# EAGLE design Adafruit Si5351A (EAGLE 7.7.0)
COMPANY: ADAFRUIT INDUSTRIES; DRAWN: KTOWN; REV: B
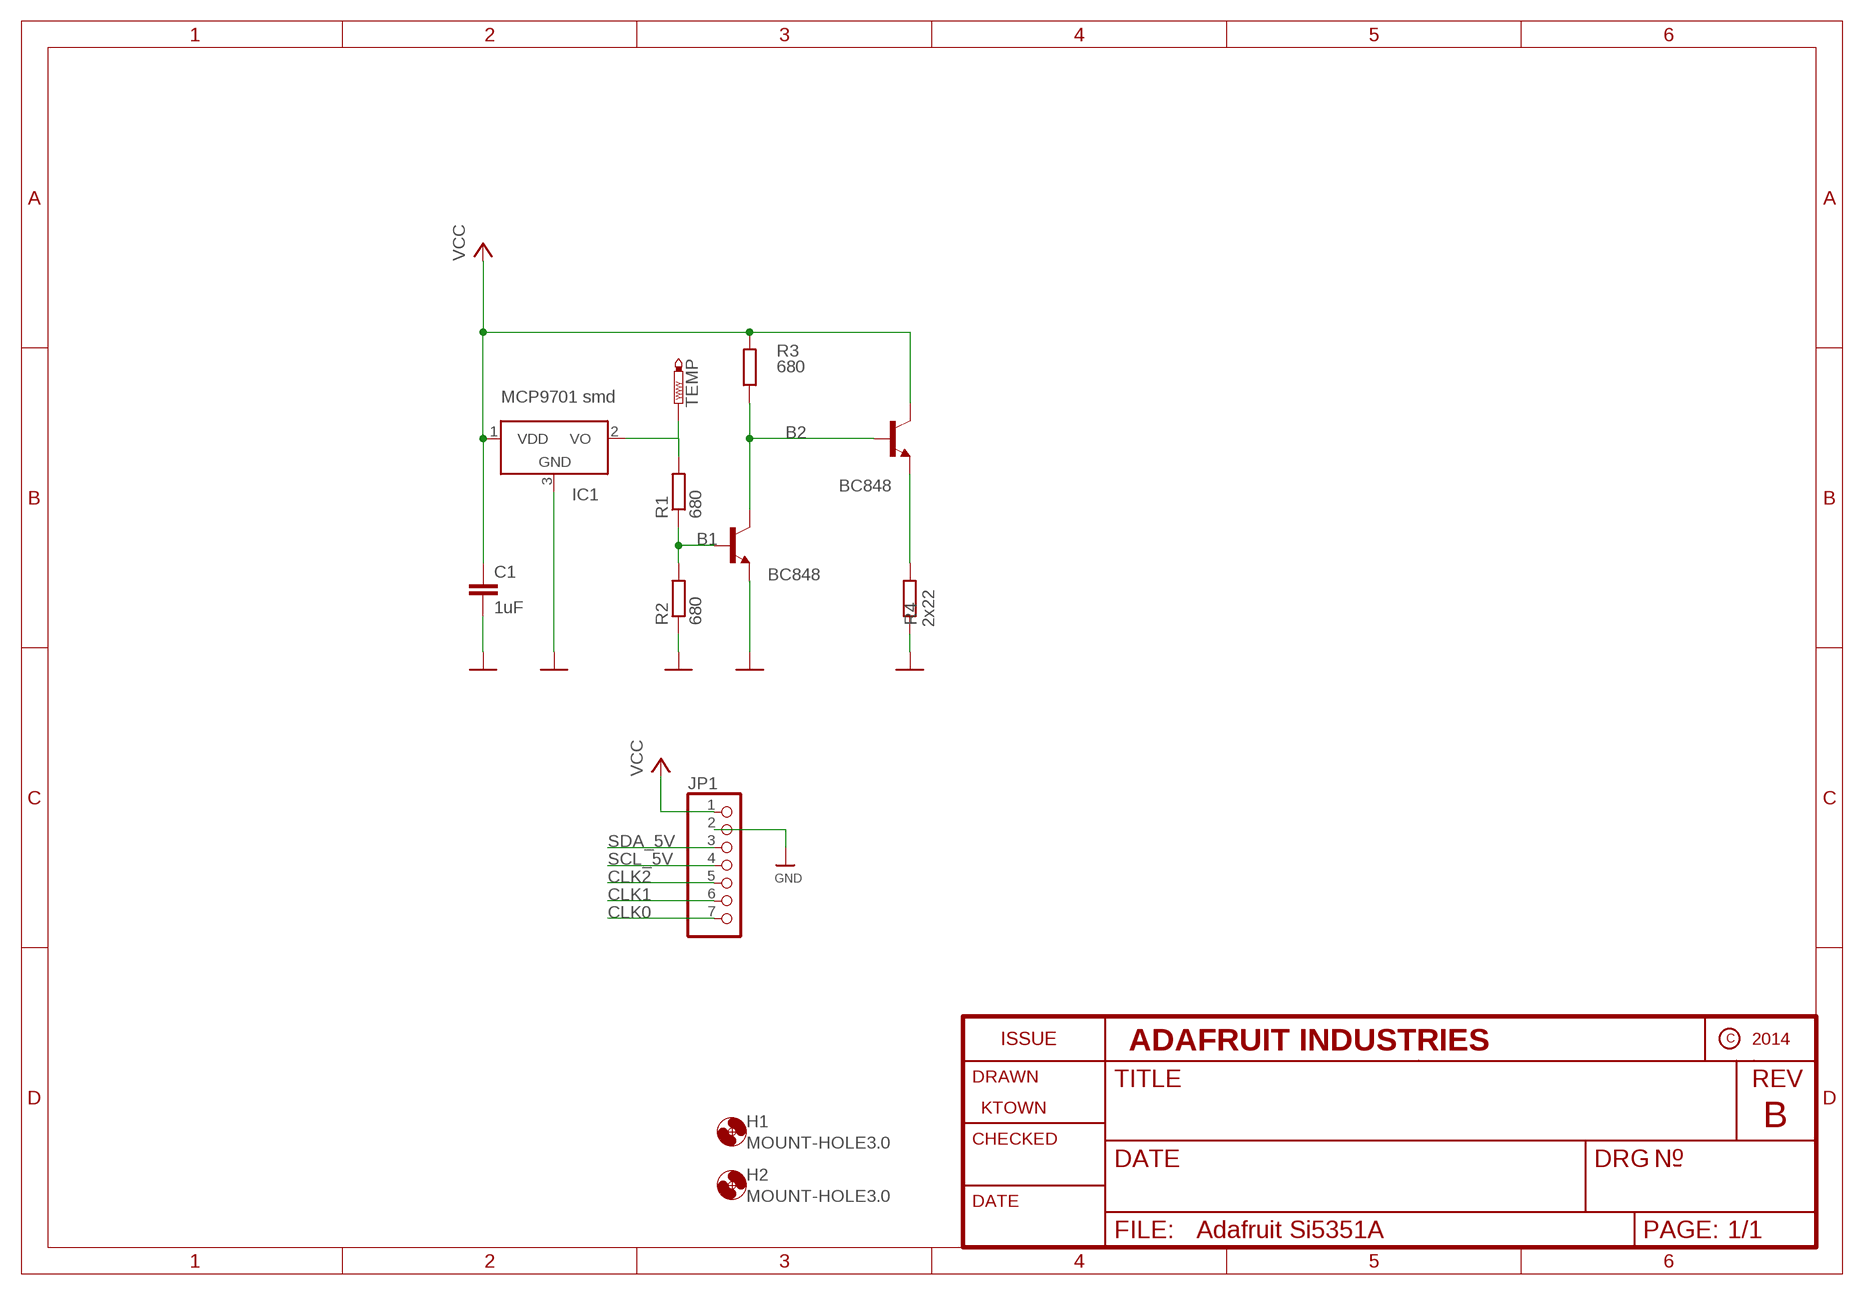
[diagram p0: schematic, sheet 1]

## Parts
C1  1uF  CAPX5R  [C1210]
H1  MOUNT-HOLE3.0  [3,0]
H2  MOUNT-HOLE3.0  [3,0]
IC1  MCP9701 smd  MCP9700T  [SOT23-3]
JP1  HEADER-1X7THICKER  [1X07_ROUND_76]
R1  680  R-EU_M1206  [M1206]
R2  680  R-EU_M1206  [M1206]
R3  680  R-EU_M1206  [M1206]
R4  2x22  R-EU_M1206  [M1206]
T1  BC848  [SOT23]
T2  BC848  [SOT23]
TEMP  PTR1TP10SQ  [TP10SQ]

## Nets
B1: R1.1 R2.2 T1.1(B)
B2: R3.1 T1.3(C) T2.1(B)
CLK0: JP1.7
CLK1: JP1.6
CLK2: JP1.5
E2: R4.2 T2.2(E)
GND: C1.2 IC1.3(GND) JP1.2 R2.1 R4.1 T1.2(E)
SCL_5V: JP1.4
SDA_5V: JP1.3
TEMP: IC1.2(VO) R1.2 TEMP.TP
VCC: C1.1 IC1.1(VDD) JP1.1 R3.2 T2.3(C)

## Library data of the parts
C1 = rcl:CAP: Fihls CAPACITOR 10uF/6V3(445-1363-1-ND), 100nF, 10nF, ..
H1 H2 = holes:MOUNT-HOLE: MOUNTING HOLE with drill center marker
IC1 = interGATE4:MCP9700T: SOT-23-3 Single-Supply Centigrade Temperature Sensor Vout = (10mV/°C x Temp °C) + ??? Digikey MCP9700T-E/TTCT-ND http://www.mouser.com/ds/2/268/21942e-53364.pdf
JP1 = microbuilder:HEADER-1X7: PIN HEADER
R1-R4 = rcl:R-EU_: RESISTOR, European symbol
T1 T2 = transistor:BC848: NPN TRANSISTOR
TEMP = testpad:PTR1: TEST PIN

## Board
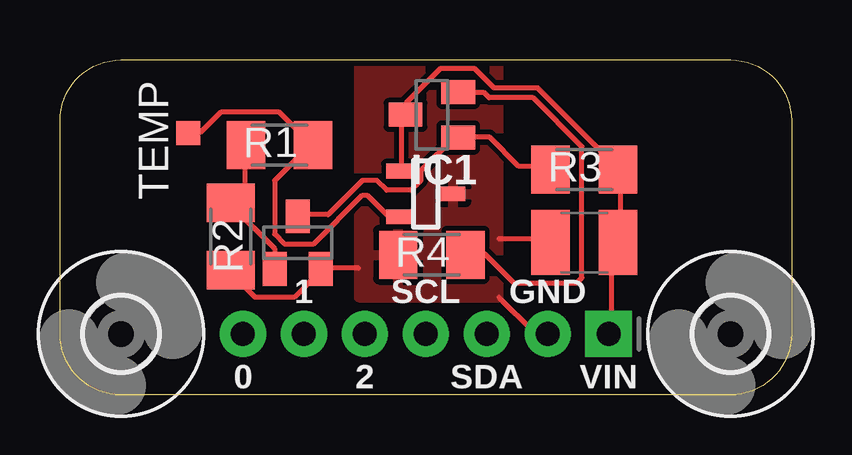
[diagram p1: board, top side]
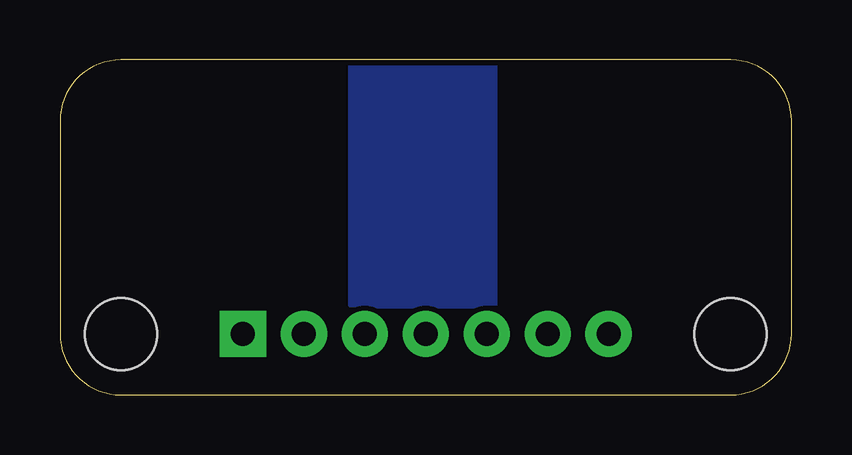
[diagram p2: board, bottom side, seen from below]

Size 30.48 x 13.97 mm. Coordinates in mm from the lower left corner, seen from the top.
Outline: 0,2.54 0,11.43 arc-90 2.54,13.97 27.94,13.97 arc-90 30.48,11.43 30.48,2.54 arc-90 27.94,0 2.54,0 arc-90 0,2.54
Copper layers (1*16): Top 0.035mm / dielectric 1.5mm / Bottom 0.035mm
Design rules "adafruit": minimum track width 8mil, minimum drill 15.5mil, track to track 8mil, track to pad 8mil, pad to pad 8mil, via to via 8mil, smd to smd 8mil, copper to edge 10mil, drill to drill 8mil, minimum pad ring 10mil, minimum via ring 8mil, stop-mask expansion 2mil, vias tented up to drill 20mil, thermal gap 10mil

### Footprints (pad centres in the part's own frame; a part is rotated, then mirrored left to right if it is on the bottom)
C1210 = smd 1.6 x 2.7: 1 -1.4,0; 2 1.4,0
3,0 = hole 3: 0,0
SOT23-3 = smd 0.61 x 1.016: 1 -0.953,-1.143; 2 0.953,-1.143; 3 0,1.143
1X07_ROUND_76 = drill 1 pad 1.93 square: 1 -7.62,0 | drill 1 pad 1.93: 2 -5.08,0; 3 -2.54,0; 4 0,0; 5 2.54,0; 6 5.08,0; 7 7.62,0
M1206 = smd 1.6 x 2: 1 -1.4,0; 2 1.4,0
SOT23 = smd 1 x 1.4: 1 -0.95,-1.1; 2 0.95,-1.1; 3 0,1.1
TP10SQ = smd 1 x 1: TP 0,0

### Placement (x,y rotation side)
C1  21.84,6.35 180 top
H1  27.94,2.54 0 top
H2  2.54,2.54 0 top
IC1  15.24,8.38 270 top
JP1  15.24,2.54 180 top
R1  9.14,10.41 0 top
R2  7.11,6.6 90 top
R3  21.84,9.4 0 top
R4  15.49,5.84 0 top
T1  9.91,6.35 0 top
T2  15.49,11.68 90 top
TEMP  5.33,10.92 0 top

### Tracks (layer width: path | path; a pad name or v marks a point on that pad's centre or on a via)
B1
  Top 0.203: T1.1 8.94,5.28 8.94,6.1 7.11,7.92 R2.2 7.11,8.13 7.72,8.74 7.72,10.36 R1.1
B2
  Top 0.203: T1.3 9.96,7.52 11.18,7.52 12.6,8.94 13.21,8.94 13.61,8.53 14.63,8.53 15.04,8.94 15.04,9.35 16.46,10.77 T2.1 16.66,10.77 17.88,10.77 19.1,9.55 20.32,9.55 R3.1
E2
  Top 0.203: T2.2 16.66,12.6 17.68,12.6 17.88,12.39 19.71,12.39 21.74,10.36 21.74,4.88 21.54,4.67 18.9,4.67 17.68,5.89 17.07,5.89 R4.2
GND
  Top 0.203: 12.45,5.28 10.97,5.28 T1.2 10.77,5.08 9.75,4.06 8.13,4.06 7.11,5.08 R2.1 | 18.29,6.5 20.32,6.5 C1.2 | 18.29,4.06 19.71,2.64 20.32,2.64 JP1.2
  pour Top: 12.45,4.06 18.29,4.06 18.29,13.97 12.45,13.97
  pour Bottom: 12.45,13.72 18.29,13.72 18.29,3.81 12.45,3.81
TEMP
  Top 0.203: IC1.2 14.02,7.52 13.61,7.52 12.8,8.33 12.6,8.33 10.57,6.3 9.35,6.3 8.94,6.71 8.94,8.94 10.36,10.36 R1.2 10.36,10.57 9.14,11.79 6.71,11.79 5.89,10.97 5.49,10.97 TEMP.TP
VCC
  Top 0.203: IC1.1 14.22,9.35 14.22,11.58 T2.3 14.43,11.79 14.43,12.19 15.85,13.61 17.27,13.61 18.09,12.8 19.91,12.8 23.16,9.55 R3.2 23.37,9.35 23.37,6.5 C1.1 23.16,6.3 22.96,6.1 22.96,2.64 JP1.1

### Text on the board
tPlace: 1 | SCL | GND | 0 | 2 | SDA | VIN